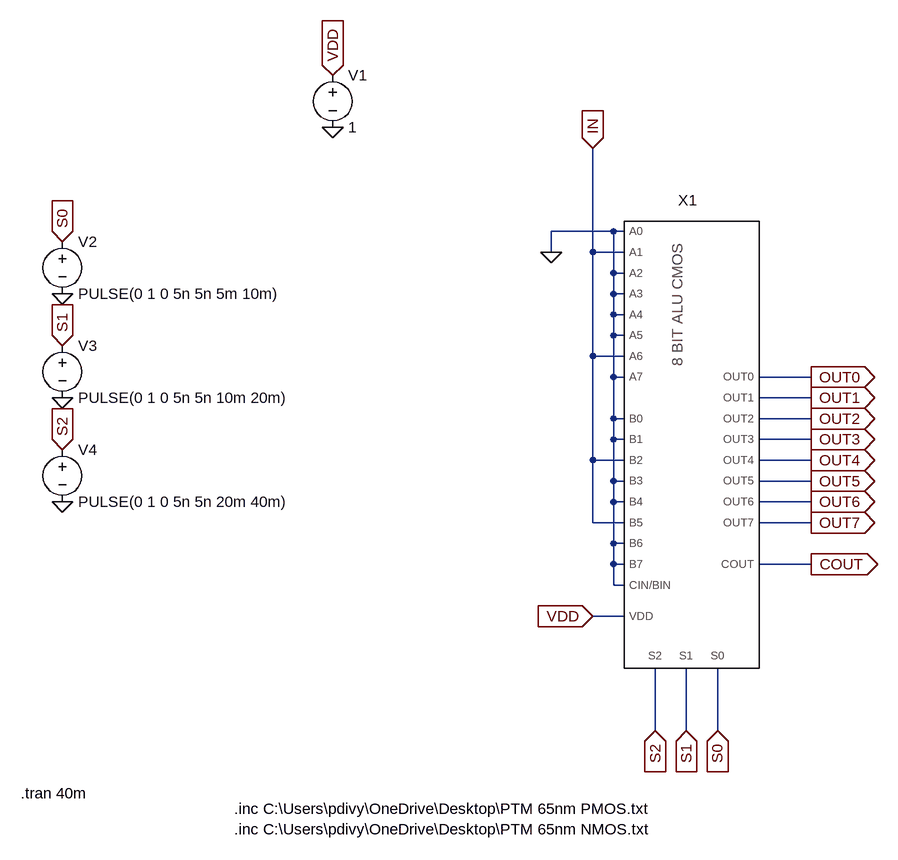
[diagram p0: schematic Draft8.asc]
Draft8.asc, the LTspice schematic file:
Version 4
SHEET 1 880 816
WIRE 80 -160 -16 -160
WIRE 96 -160 80 -160
WIRE -16 -128 -16 -160
WIRE 48 -128 48 -288
WIRE 96 -128 48 -128
WIRE 80 -96 80 -160
WIRE 96 -96 80 -96
WIRE 80 -64 80 -96
WIRE 96 -64 80 -64
WIRE 80 -32 80 -64
WIRE 96 -32 80 -32
WIRE 80 0 80 -32
WIRE 96 0 80 0
WIRE 48 32 48 -128
WIRE 96 32 48 32
WIRE 80 64 80 0
WIRE 96 64 80 64
WIRE 384 64 304 64
WIRE 384 96 304 96
WIRE 80 128 80 64
WIRE 96 128 80 128
WIRE 384 128 304 128
WIRE 80 160 80 128
WIRE 96 160 80 160
WIRE 384 160 304 160
WIRE 48 192 48 32
WIRE 96 192 48 192
WIRE 384 192 304 192
WIRE 80 224 80 160
WIRE 96 224 80 224
WIRE 384 224 304 224
WIRE 80 256 80 224
WIRE 96 256 80 256
WIRE 384 256 304 256
WIRE 48 288 48 192
WIRE 96 288 48 288
WIRE 384 288 304 288
WIRE 80 320 80 256
WIRE 96 320 80 320
WIRE 80 352 80 320
WIRE 96 352 80 352
WIRE 384 352 304 352
WIRE 80 384 80 352
WIRE 96 384 80 384
WIRE 96 432 48 432
WIRE 144 608 144 512
WIRE 192 608 192 512
WIRE 240 608 240 512
FLAG 144 608 S2
IOPIN 144 608 In
FLAG 192 608 S1
IOPIN 192 608 In
FLAG 240 608 S0
IOPIN 240 608 In
FLAG 384 64 OUT0
IOPIN 384 64 Out
FLAG 384 96 OUT1
IOPIN 384 96 Out
FLAG 384 128 OUT2
IOPIN 384 128 Out
FLAG 384 160 OUT3
IOPIN 384 160 Out
FLAG 384 192 OUT4
IOPIN 384 192 Out
FLAG 384 224 OUT5
IOPIN 384 224 Out
FLAG 384 256 OUT6
IOPIN 384 256 Out
FLAG 384 288 OUT7
IOPIN 384 288 Out
FLAG 384 352 COUT
IOPIN 384 352 Out
FLAG 48 432 VDD
IOPIN 48 432 In
FLAG -352 -320 0
FLAG -352 -400 VDD
IOPIN -352 -400 In
FLAG 48 -288 IN
IOPIN 48 -288 In
FLAG -16 -128 0
FLAG -768 256 0
FLAG -768 96 0
FLAG -768 -64 0
FLAG -768 -144 S0
IOPIN -768 -144 In
FLAG -768 16 S1
IOPIN -768 16 In
FLAG -768 176 S2
IOPIN -768 176 In
SYMBOL voltage -352 -416 R0
WINDOW 123 0 0 Left 0
WINDOW 39 0 0 Left 0
SYMATTR InstName V1
SYMATTR Value 1
SYMBOL voltage -768 -160 R0
WINDOW 123 0 0 Left 0
WINDOW 39 0 0 Left 0
SYMATTR InstName V2
SYMATTR Value PULSE(0 1 0 5n 5n 5m 10m)
SYMBOL voltage -768 0 R0
WINDOW 123 0 0 Left 0
WINDOW 39 0 0 Left 0
SYMATTR InstName V3
SYMATTR Value PULSE(0 1 0 5n 5n 10m 20m)
SYMBOL voltage -768 160 R0
WINDOW 123 0 0 Left 0
WINDOW 39 0 0 Left 0
SYMATTR InstName V4
SYMATTR Value PULSE(0 1 0 5n 5n 20m 40m)
SYMBOL EightBitALU_CMOS 192 176 R0
SYMATTR InstName X1
TEXT -832 704 Left 2 !.tran 40m
TEXT -504 728 Left 2 !.inc C:\\Users\\pdivy\\OneDrive\\Desktop\\PTM 65nm PMOS.txt
TEXT -504 760 Left 2 !.inc C:\\Users\\pdivy\\OneDrive\\Desktop\\PTM 65nm NMOS.txt

The netlist it stands for:
* Draft8.asc
V1 VDD 0 1
V2 S0 0 PULSE(0 1 0 5n 5n 5m 10m)
V3 S1 0 PULSE(0 1 0 5n 5n 10m 20m)
V4 S2 0 PULSE(0 1 0 5n 5n 20m 40m)
XX1 0 IN 0 0 0 0 IN 0 0 0 IN 0 0 IN 0 0 0 S0 S1 S2 VDD COUT OUT0 OUT1 OUT2 OUT3 OUT4 OUT5 OUT6 OUT7 EightBitALU_CMOS  ; pins A0 A1 A2 A3 A4 A5 A6 A7 B0 B1 B2 B3 B4 B5 B6 B7 CIN/BIN S0 S1 S2 VDD COUT OUT0 OUT1 OUT2 OUT3 OUT4 OUT5 OUT6 OUT7
.tran 40m
.inc C:\Users\pdivy\OneDrive\Desktop\PTM 65nm PMOS.txt
.inc C:\Users\pdivy\OneDrive\Desktop\PTM 65nm NMOS.txt
.backanno
.end